# Altium schematic sheet AMPM_M95.SchDoc
size C
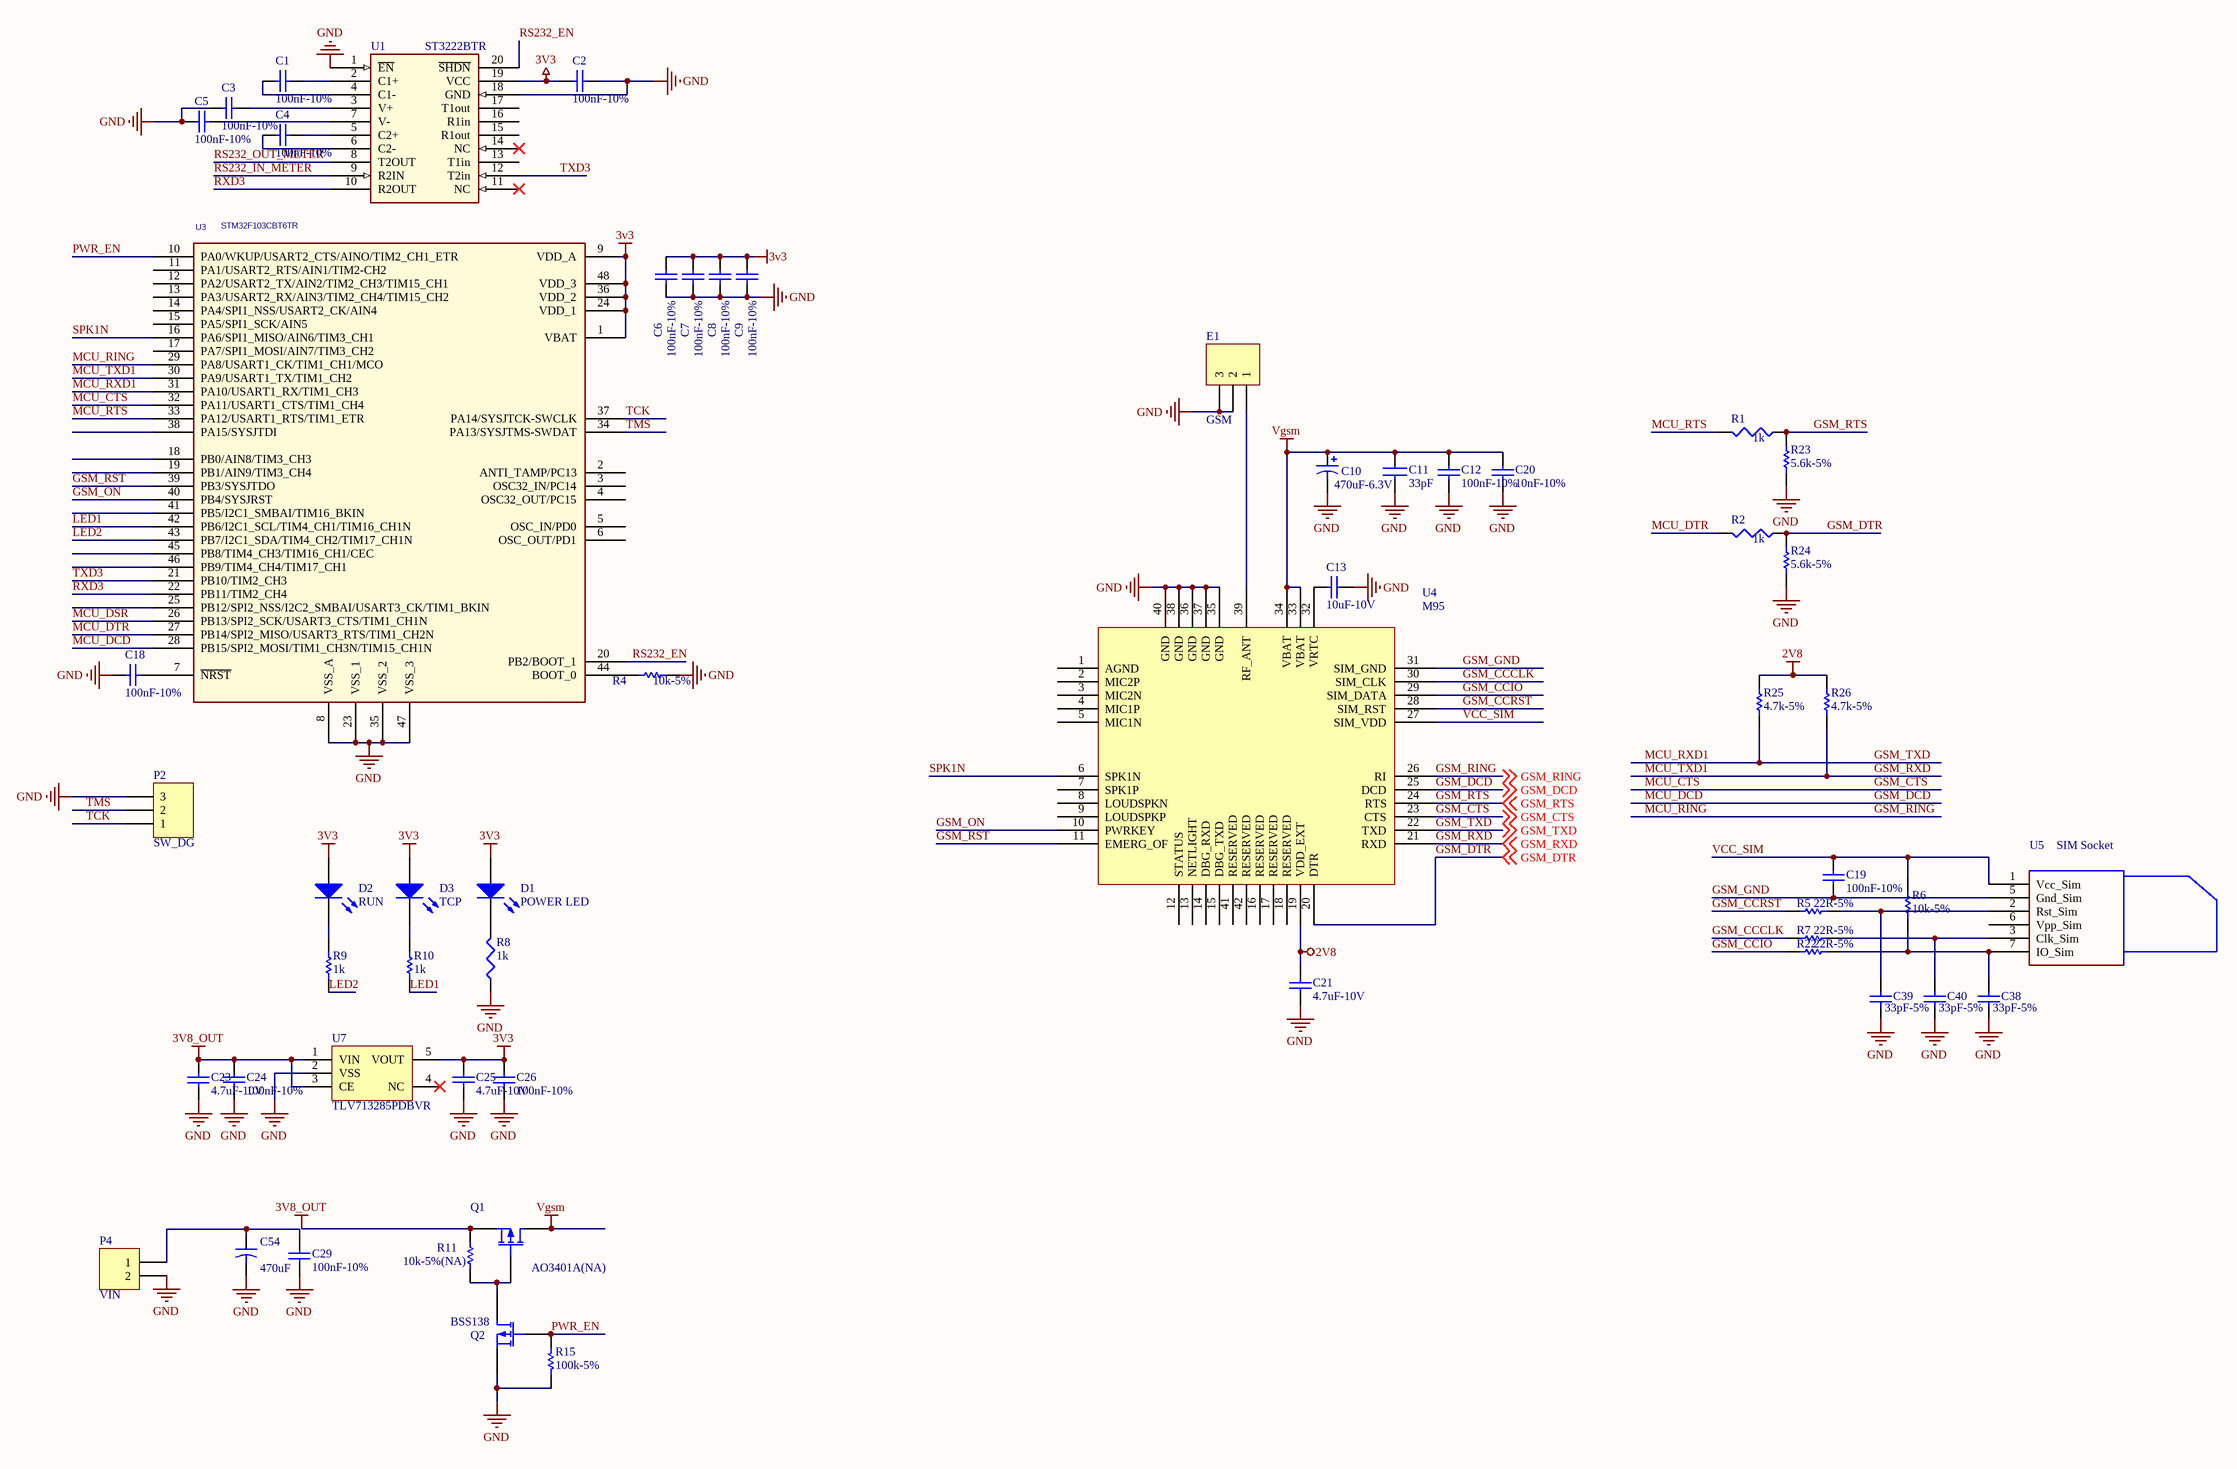
[diagram p0: AMPM_M95.SchDoc]

## Parts
C1  100nF-10%  [C0805 - small]
C2  100nF-10%  [C0805 - small]
C3  100nF-10%  [C0805 - small]
C4  100nF-10%  [C0805 - small]
C5  100nF-10%  [C0805 - small]
C6  100nF-10%  [C0805 - small]
C7  100nF-10%  [C0805 - small]
C8  100nF-10%  [C0805 - small]
C9  100nF-10%  [C0805 - small]
C10  470uF-6.3V  [C2917]
C11  33pF  [C0805 - small]
C12  100nF-10%  [C0805 - small]
C13  10uF-10V  [C0805 - small]
C18  100nF-10%  [C0805 - small]
C19  100nF-10%  [C0805 - small]
C20  10nF-10%  [C0805 - small]
C21  4.7uF-10V  [C0805 - small]
C23  4.7uF-10V  [C0805 - small]
C24  100nF-10%  [C0805 - small]
C25  4.7uF-10V  [C0805 - small]
C26  100nF-10%  [C0805 - small]
C29  100nF-10%  [C0805 - small]
C38  33pF-5%  [C0805 - small]
C39  33pF-5%  [C0805 - small]
C40  33pF-5%  [C0805 - small]
C54  470uF  [C2917]
D1  POWER LED  [LED0805-R]
D2  RUN  [LED0805-R]
D3  TCP  [LED0805-R]
E1  GSM  [IPX SMD PCB Plug]
P2  SW_DG  [HDR1X3]
P4  VIN  [Header 1X2]
Q1  AO3401A(NA)  [SOT23-3]
Q2  BSS138  [SOT23-3]
R1  1k  [R0805 - SMALL]
R2  1k  [R0805 - SMALL]
R4  10k-5%  [R0805 - small]
R5  22R-5%  [R0805 - small]
R6  10k-5%  [R0805 - small]
R7  22R-5%  [R0805 - small]
R8  1k  [R0805 - SMALL]
R9  1k  [R0805 - small]
R10  1k  [R0805 - small]
R11  10k-5%(NA)  [R0805 - small]
R15  100k-5%  [R0805 - small]
R22  22R-5%  [R0805 - small]
R23  5.6k-5%  [R0805 - small]
R24  5.6k-5%  [R0805 - small]
R25  4.7k-5%  [R0805 - small]
R26  4.7k-5%  [R0805 - small]
U1  ST3222BTR  [SSOP-20]
U3  STM32F103CBT6TR  [TQFP-48-P0.5]
U4  M95  [M95]
U5  SIM Socket  [SIM CARD HOLDER - duplicate - duplicate]
U7  TLV713285PDBVR  [SOT23-5]

## Nets
2V8: C21.2 R25.2 R26.2 U4.19(VDD_EXT)
3V3: C2.2 C6.1 C7.1 C8.1 C9.1 C25.2 C26.1 D1.1(A) D2.1(A) D3.1(A) U1.19(VCC) U3.1(VBAT) U3.9(VDD_A) U3.24(VDD_1) U3.36(VDD_2) U3.48(VDD_3) U7.5(VOUT)
3V8_OUT: C23.2 C24.1 Q1.2(S) R11.2 U7.1(VIN) U7.3(CE)
GND: C2.1 C3.2 C5.2 C6.2 C7.2 C8.2 C9.2 C10.2 C11.2 C12.2 C13.1 C18.1 C20.1 C21.1 C23.1 C24.2 C25.1 C26.2 C29.1 C38.1 C39.1 C40.1 C54.2 E1.2 E1.3 P2.3 P4.2 Q2.2(S) R4.1 R8.1 R15.2 R23.1 R24.1 U1.1(~{EN}) U1.18(GND) U3.8(VSS_A) U3.23(VSS_1) U3.35(VSS_2) U3.47(VSS_3) U4.35(GND) U4.36(GND) U4.37(GND) U4.38(GND) U4.40(GND) U7.2(VSS)
Vgsm: C10.1 C11.1 C12.1 C20.2 Q1.3(D) U4.33(VBAT) U4.34(VBAT)
GSM_CCCLK: R7.1 U4.30(SIM_CLK)
GSM_CCIO: R22.1 U4.29(SIM_DATA)
GSM_CCRST: R5.1 U4.28(SIM_RST)
GSM_CTS: U3.32(PA11/USART1_CTS/TIM1_CH4) U4.23(CTS) ; off-sheet GSM_CTS  [also labelled MCU_CTS]
GSM_DCD: U3.28(PB15/SPI2_MOSI/TIM1_CH3N/TIM15_CH1N) U4.25(DCD) ; off-sheet GSM_DCD  [also labelled MCU_DCD]
GSM_DTR: R2.1 R24.2 U4.20(DTR) ; off-sheet GSM_DTR
GSM_GND: C19.2 U4.31(SIM_GND) U5.5(Gnd_Sim)
GSM_ON: U3.40(PB4/SYSJRST) U4.10(PWRKEY)
GSM_RING: U3.29(PA8/USART1_CK/TIM1_CH1/MCO) U4.26(RI) ; off-sheet GSM_RING  [also labelled MCU_RING]
GSM_RST: U3.39(PB3/SYSJTDO) U4.11(EMERG_OF)
GSM_RTS: R1.1 R23.2 U4.24(RTS) ; off-sheet GSM_RTS
GSM_RXD: R26.1 U3.30(PA9/USART1_TX/TIM1_CH2) U4.21(RXD) ; off-sheet GSM_RXD  [also labelled MCU_TXD1]
GSM_TXD: R25.1 U3.31(PA10/USART1_RX/TIM1_CH3) U4.22(TXD) ; off-sheet GSM_TXD  [also labelled MCU_RXD1]
LED1: R10.2 U3.42(PB6/I2C1_SCL/TIM4_CH1/TIM16_CH1N)
LED2: R9.2 U3.43(PB7/I2C1_SDA/TIM4_CH2/TIM17_CH1N)
MCU_DSR: U3.26(PB13/SPI2_SCK/USART3_CTS/TIM1_CH1N)
MCU_DTR: R2.2 U3.27(PB14/SPI2_MISO/USART3_RTS/TIM1_CH2N)
MCU_RTS: R1.2 U3.33(PA12/USART1_RTS/TIM1_ETR)
PWR_EN: Q2.1(G) R15.1 U3.10(PA0/WKUP/USART2_CTS/AINO/TIM2_CH1_ETR)
RS232_EN: U1.20(~{SHDN}) U3.20(PB2/BOOT_1)
RS232_IN_METER: U1.9(R2IN)
RS232_OUT_METER: U1.8(T2OUT)
RXD3: U1.10(R2OUT) U3.22(PB11/TIM2_CH4)
SPK1N: U3.16(PA6/SPI1_MISO/AIN6/TIM3_CH1) U4.6(SPK1N)
TCK: P2.1 U3.37(PA14/SYSJTCK-SWCLK)
TMS: P2.2 U3.34(PA13/SYSJTMS-SWDAT)
TXD3: U1.12(T2in) U3.21(PB10/TIM2_CH3)
VCC_SIM: C19.1 R6.2 U4.27(SIM_VDD) U5.1(Vcc_Sim)
NetC1_1: C1.1 U1.2(C1+)
NetC1_2: C1.2 U1.4(C1-)
NetC3_1: C3.1 U1.3(V+)
NetC4_1: C4.1 U1.5(C2+)
NetC4_2: C4.2 U1.6(C2-)
NetC5_1: C5.1 U1.7(V-)
NetC13_2: C13.2 U4.32(VRTC)
NetC18_2: C18.2 U3.7(~{NRST})
NetC29_2: C29.2 C54.1 P4.1
NetC38_2: C38.2 R6.1 R22.2 U5.7(IO_Sim)
NetC39_2: C39.2 R5.2 U5.2(Rst_Sim)
NetC40_2: C40.2 R7.2 U5.3(Clk_Sim)
NetD1_2: D1.2(K) R8.2
NetD2_2: D2.2(K) R9.1
NetD3_2: D3.2(K) R10.1
NetE1_1: E1.1 U4.39(RF_ANT)
NetQ1_1: Q1.1(G) Q2.3(D) R11.1
NetR4_2: R4.2 U3.44(BOOT_0)

Not connected (* = marked no-connect by the designer): U1 11(NC)* 13(T1in) 14(NC)* 15(R1out) 16(R1in) 17(T1out); U3 2(ANTI_TAMP/PC13) 3(OSC32_IN/PC14) 4(OSC32_OUT/PC15) 5(OSC_IN/PD0) 6(OSC_OUT/PD1) 11(PA1/USART2_RTS/AIN1/TIM2-CH2) 12(PA2/USART2_TX/AIN2/TIM2_CH3/TIM15_CH1) 13(PA3/USART2_RX/AIN3/TIM2_CH4/TIM15_CH2) 14(PA4/SPI1_NSS/USART2_CK/AIN4) 15(PA5/SPI1_SCK/AIN5) 17(PA7/SPI1_MOSI/AIN7/TIM3_CH2) 18(PB0/AIN8/TIM3_CH3) 19(PB1/AIN9/TIM3_CH4) 25(PB12/SPI2_NSS/I2C2_SMBAI/USART3_CK/TIM1_BKIN) 38(PA15/SYSJTDI) 41(PB5/I2C1_SMBAI/TIM16_BKIN) 45(PB8/TIM4_CH3/TIM16_CH1/CEC) 46(PB9/TIM4_CH4/TIM17_CH1); U4 1(AGND) 2(MIC2P) 3(MIC2N) 4(MIC1P) 5(MIC1N) 7(SPK1P) 8(LOUDSPKN) 9(LOUDSPKP) 12(STATUS) 13(NETLIGHT) 14(DBG_RXD) 15(DBG_TXD) 16(RESERVED) 17(RESERVED) 18(RESERVED) 41(RESERVED) 42(RESERVED); U5 6(Vpp_Sim); U7 4(NC)*

## Library data of the parts
C1-C9 C12 C18 C19 C24 C26 C29 = 100nF-50V-C0805: Non-Polarized Capacitor; Manufacturer: Yageo; Manufacturer Part Number: CC0805KRX7R9BB104; Value: 100nF-10%; Digi-Key Part Number: 311-1140-1-ND; Unit Price: 0.1
C10 = 470uF-6.3V-Tantalum: Tantalum Capacitor; Manufacturer: AVX Corporation; Manufacturer Part Number: TAJY477K006RNJ; Value: 470uF-6.3V; Digi-Key Part Number: 478-4706-1-ND; Unit Price: 2.46
C11 = CAP NP
C13 = 10uF-10V-C0805: Non-Polarized Capacitor; Manufacturer: Yageo; Manufacturer Part Number: CC0805ZKY5V6BB106; Value: 10uF-10V; Digi-Key Part Number: 311-1355-1-ND; Unit Price: 0.16
C20 = 10nF-50V-C0805: Non-Polarized Capacitor; Manufacturer: Yageo; Manufacturer Part Number: CC0805KRX7R9BB103; Value: 10nF-10%; Digi-Key Part Number: 311-1136-1-ND; Unit Price: 0.1
C21 C23 C25 = 4.7uF-10V-C0805: Non-Polarized Capacitor; Manufacturer: Yageo; Manufacturer Part Number: CC0805ZRY5V6BB475; Value: 4.7uF-10V; Digi-Key Part Number: 311-1371-1-ND; Unit Price: 0.1
C38-C40 = 33pF-50V-C0805: Non-Polarized Capacitor; Manufacturer: Yageo; Manufacturer Part Number: CC0805JRNPO9BN330; Value: 33pF-5%; Digi-Key Part Number: 311-1105-1-ND; Unit Price: 0.1
C54 = Cap2: CAP TANT 470UF 6.3V 10% 2917; Manufacturer: Kemet; Manufacturer Part Number: T495D477K006ATE100; Published: 23-Sep-2002; PackageReference: CAPR5-4X5; Publisher: Altium Limited; Value: 470uF; Digi-Key Part Number: 399-4701-2-ND; Unit Price: 0.5
D1-D3 = LED2: Typical RED, GREEN, YELLOW, AMBER GaAs LED; Published: 8-Jun-2000; LatestRevisionDate: 17-Jul-2002; LatestRevisionNote: Re-released for DXP Platform.; PackageVersion: Feb-2002; PackageReference: 3.2X1.6X1.1; Publisher: Altium Limited
E1 P2 = Header 3: Header, 3-Pin; LatestRevisionDate: 17-Jul-2002; LatestRevisionNote: Re-released for DXP Platform.; Publisher: Altium Limited
P4 = Header 1X2: Header, 2-Pin
Q1 = MOSFET-P: MOSFET P-CH -30V -4.3A SOT23; Manufacturer: Alpha & Omega Semiconductor Inc; Published: 8-Jun-2000; LatestRevisionDate: 17-Jul-2002; LatestRevisionNote: Re-released for DXP Platform.; PackageVersion: 1995/1996; PackageReference: E3; Publisher: Altium Limited; Digi-Key Part Number: 785-1001-1-ND; Manufacturer Part Number: AO3401A; Unit Price: 0.12400; Remark: NA
Q2 = MOSFET-P: MOSFET N-CH 50V 200MA SOT23-3; Manufacturer: Diodes Inc; Manufacturer Part Number: BSS138-7-F; Published: 8-Jun-2000; LatestRevisionDate: 17-Jul-2002; LatestRevisionNote: Re-released for DXP Platform.; PackageVersion: 1995/1996; PackageReference: E3; Publisher: Altium Limited; Digi-Key Part Number: BSS138-FDICT-ND; Unit Price: 0.06575
R1 R2 R8 = Res3: Resistor; Published: 8-Jun-2000; LatestRevisionDate: 29-May-2009; LatestRevisionNote: IPC-7351 Footprint Added.; PackageReference: J1-0603; Publisher: Altium Limited; PackageDescription: Chip Resistor
R4 R11 = Res1: RES 10K OHM 1/16W 5% 0402 SMD; Manufacturer: Yageo; Manufacturer Part Number: RC0402JR-0710KL; Published: 8-Jun-2000; LatestRevisionDate: 17-Jul-2002; LatestRevisionNote: Re-released for DXP Platform.; PackageReference: R0603; Publisher: Altium Limited; Digi-Key Part Number: 311-10KJRCT-ND; Unit Price: 0.00178
  R4: Value: 10k-5%
  R11: Value: 10k-5%(NA); Remark: NA
R5 R7 R22 = 22R-5%-R0805: RES 22 OHM 1/8W 5% 0805 SMD; Manufacturer: Yageo; Manufacturer Part Number: RC0805JR-0722RL; Digi-Key Part Number: 311-22ARTR-ND; Unit Price: 0.00209
R6 = 10k-5%-R0805: RES 10k OHM 1/8W 5% 0805 SMD; Manufacturer: Yageo; Manufacturer Part Number: RC0805JR-0710KL; Digi-Key Part Number: 311-10KARTR-ND; Unit Price: 0.00209
R9 R10 = Res1: Resistor Type 0805 SMD; Published: 8-Jun-2000; LatestRevisionDate: 17-Jul-2002; LatestRevisionNote: Re-released for DXP Platform.; PackageReference: AXIAL-0.3; Publisher: Altium Limited; Value: 1k
R15 = Res1: RES 100K OHM 1/16W 5% 0402 SMD; Manufacturer: Yageo; Manufacturer Part Number: RC0402JR-07100KL; Published: 8-Jun-2000; LatestRevisionDate: 17-Jul-2002; LatestRevisionNote: Re-released for DXP Platform.; PackageReference: R0402; Publisher: Altium Limited; Value: 100k-5%; Digi-Key Part Number: 311-100KJRCT-ND; Unit Price: 0.00171
R23 R24 = 5.6k-5%-R0805: RES 5.6k OHM 1/8W 5% 0805 SMD; Manufacturer: Yageo; Manufacturer Part Number: RC0805JR-075K6L; Digi-Key Part Number: 311-5.6KARTR-ND; Unit Price: 0.00209
R25 R26 = 4.7k-5%-R0805: RES 4.7k OHM 1/8W 5% 0805 SMD; Manufacturer: Yageo; Manufacturer Part Number: RC0805JR-074K7L; Digi-Key Part Number: 311-4.7KARTR-ND; Unit Price: 0.00209
U1 = MAX3222_0
U3 = ATmega128_4: MCU ARM 128K FLASH/TIMER; Manufacturer: STMicroelectronics; Digi-Key Part Number: 497-6288-ND; Manufacturer Part Number: STM32F103CBT6TR; Unit Price: 2
U5 = TMS370C320/LCC_8
U7 = XC6209-3.3V: IC REG LDO 3.3V 0.15A SOT23-5; Manufacturer: Texas Instruments; Manufacturer Part Number: TLV71333PDBVR; Digi-Key Part Number: 296-35591-2-ND; Unit Price: 0.12750